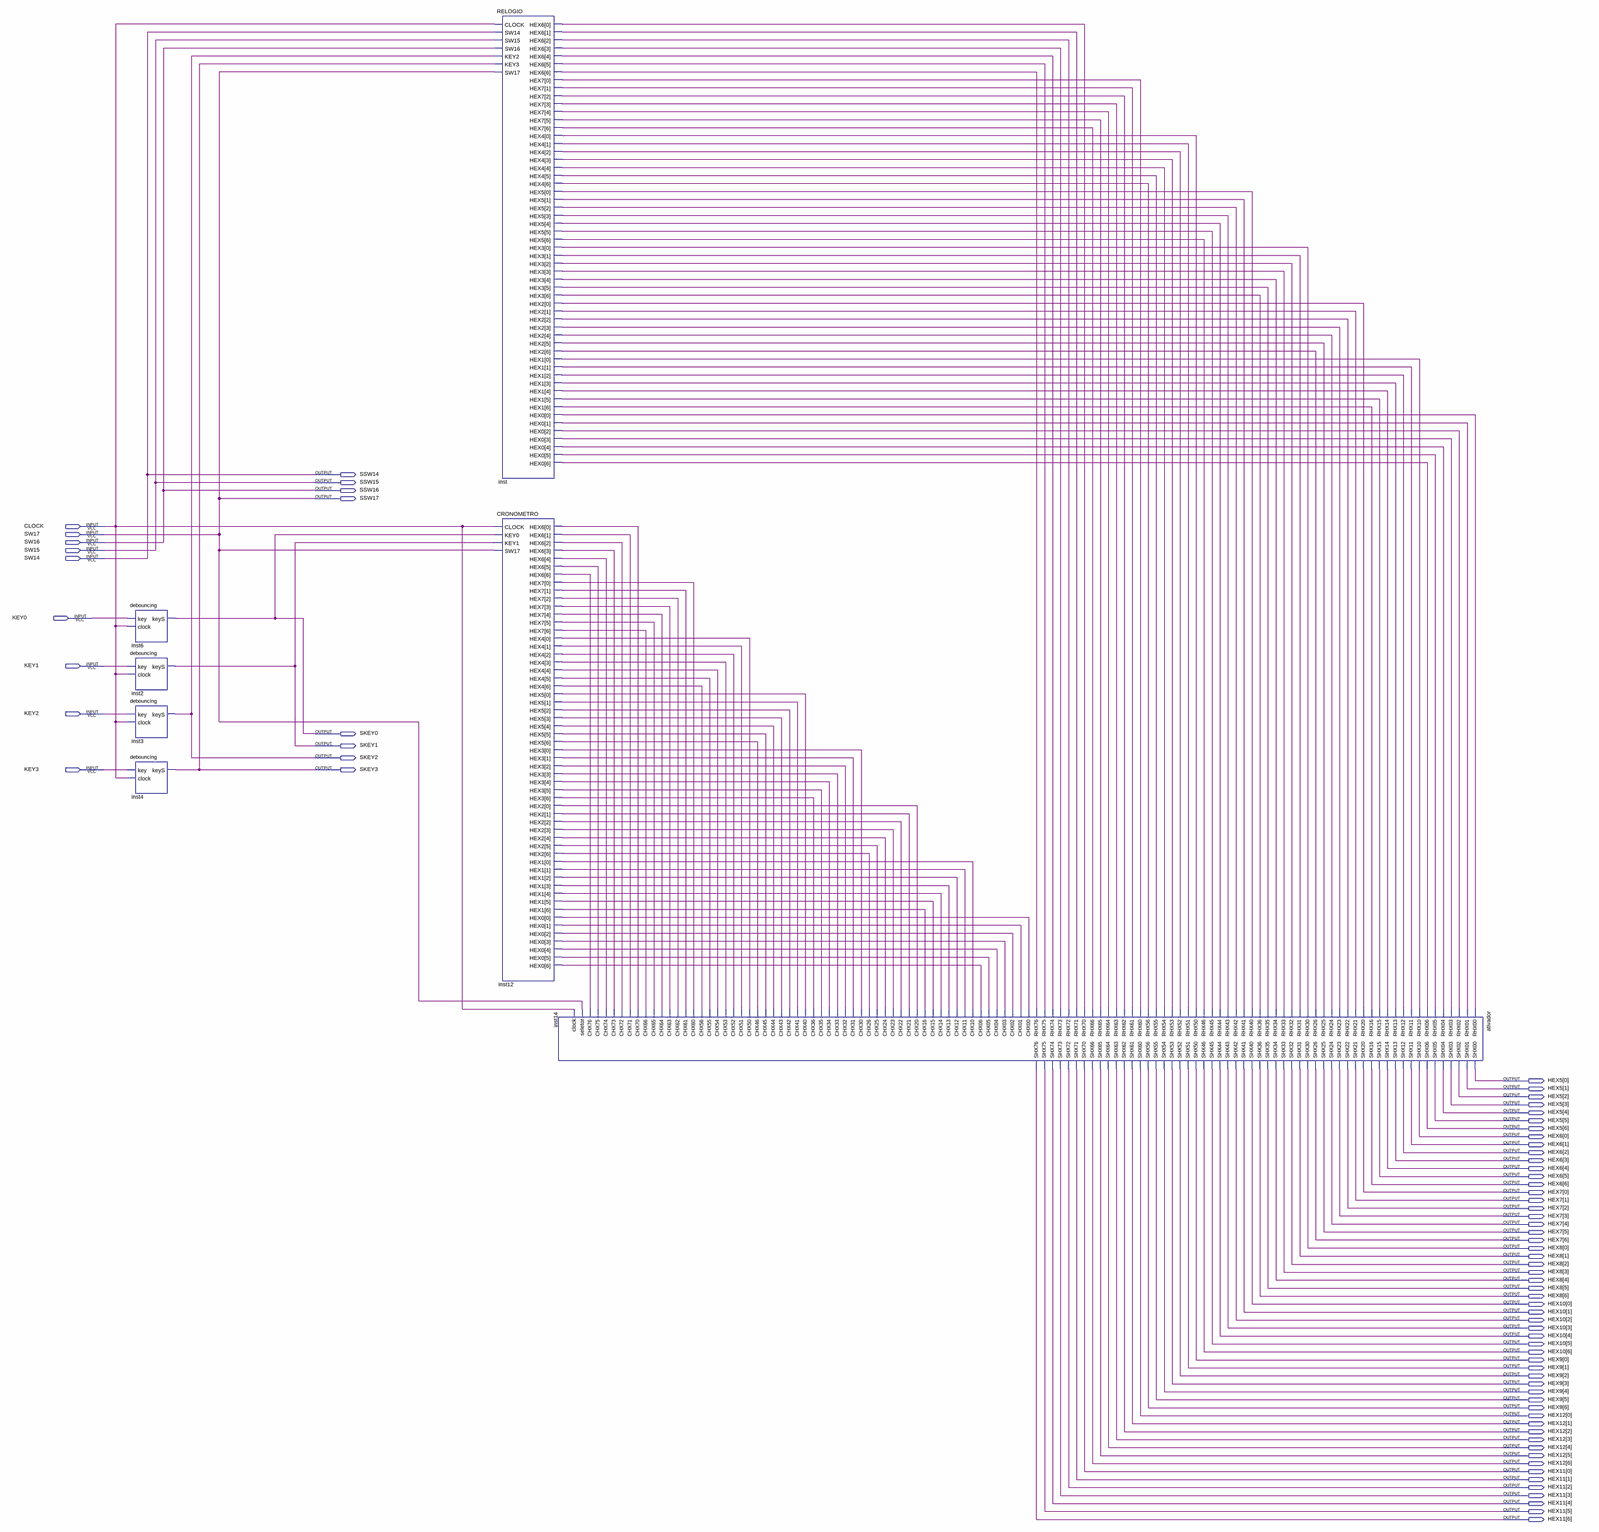
[diagram p0: schematic sheet, whole]
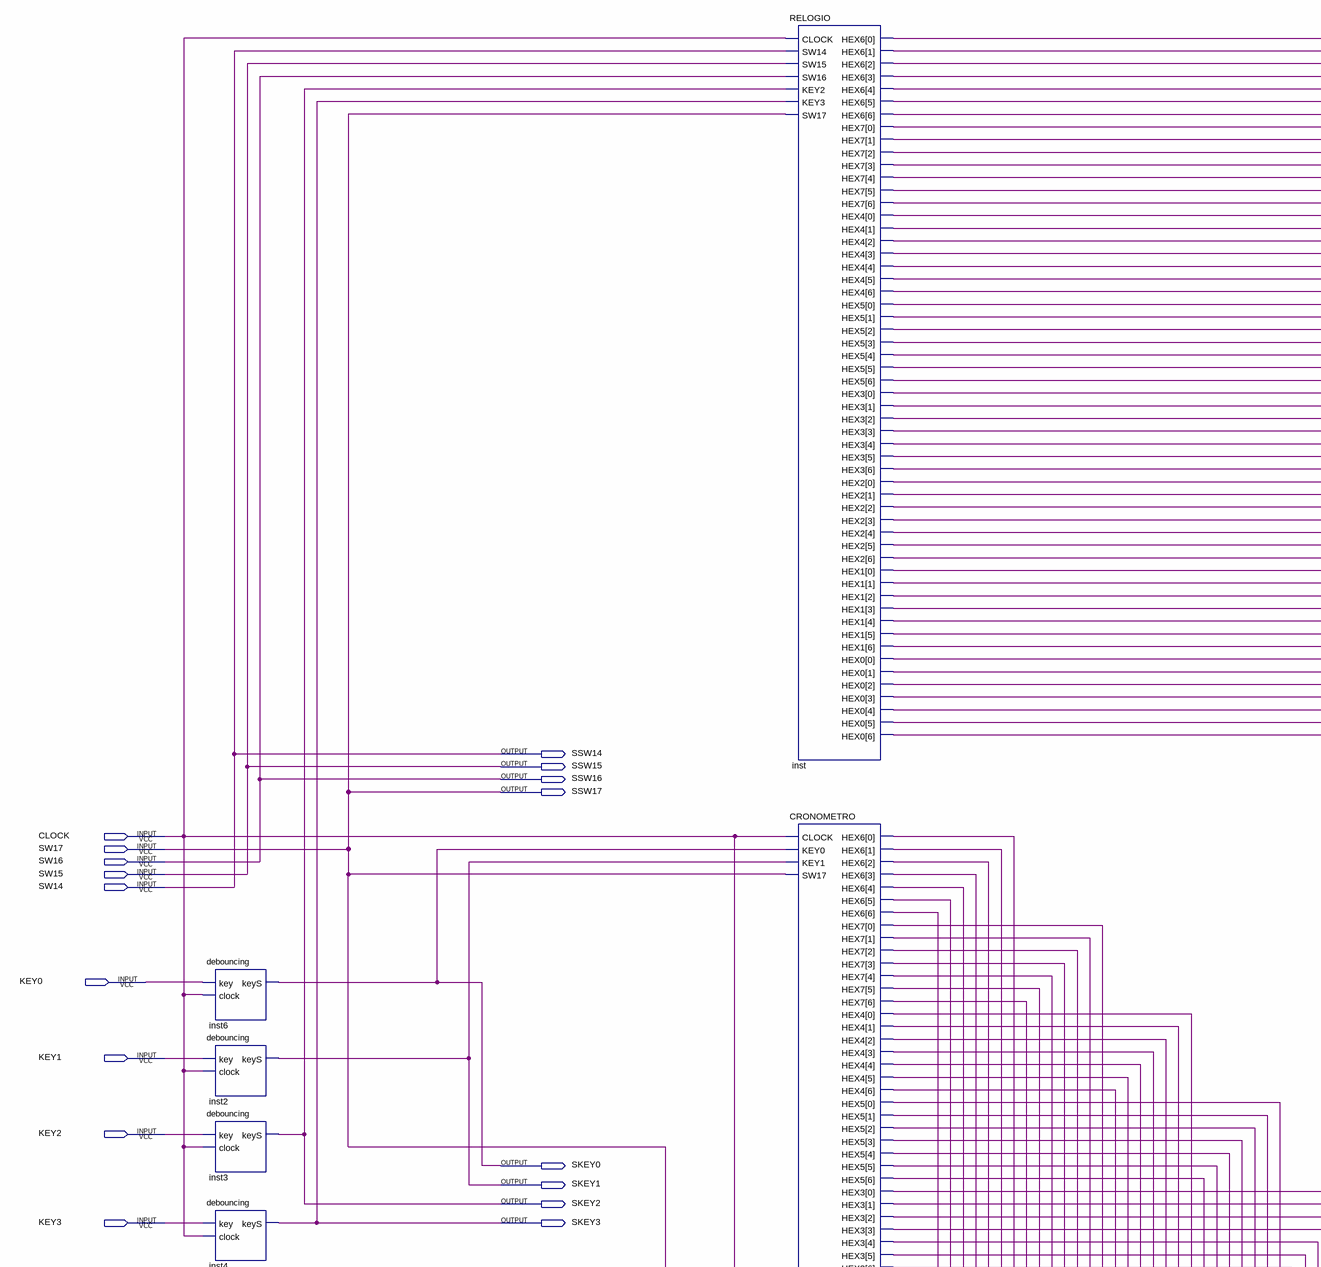
[diagram p1: schematic sheet, upper left part]
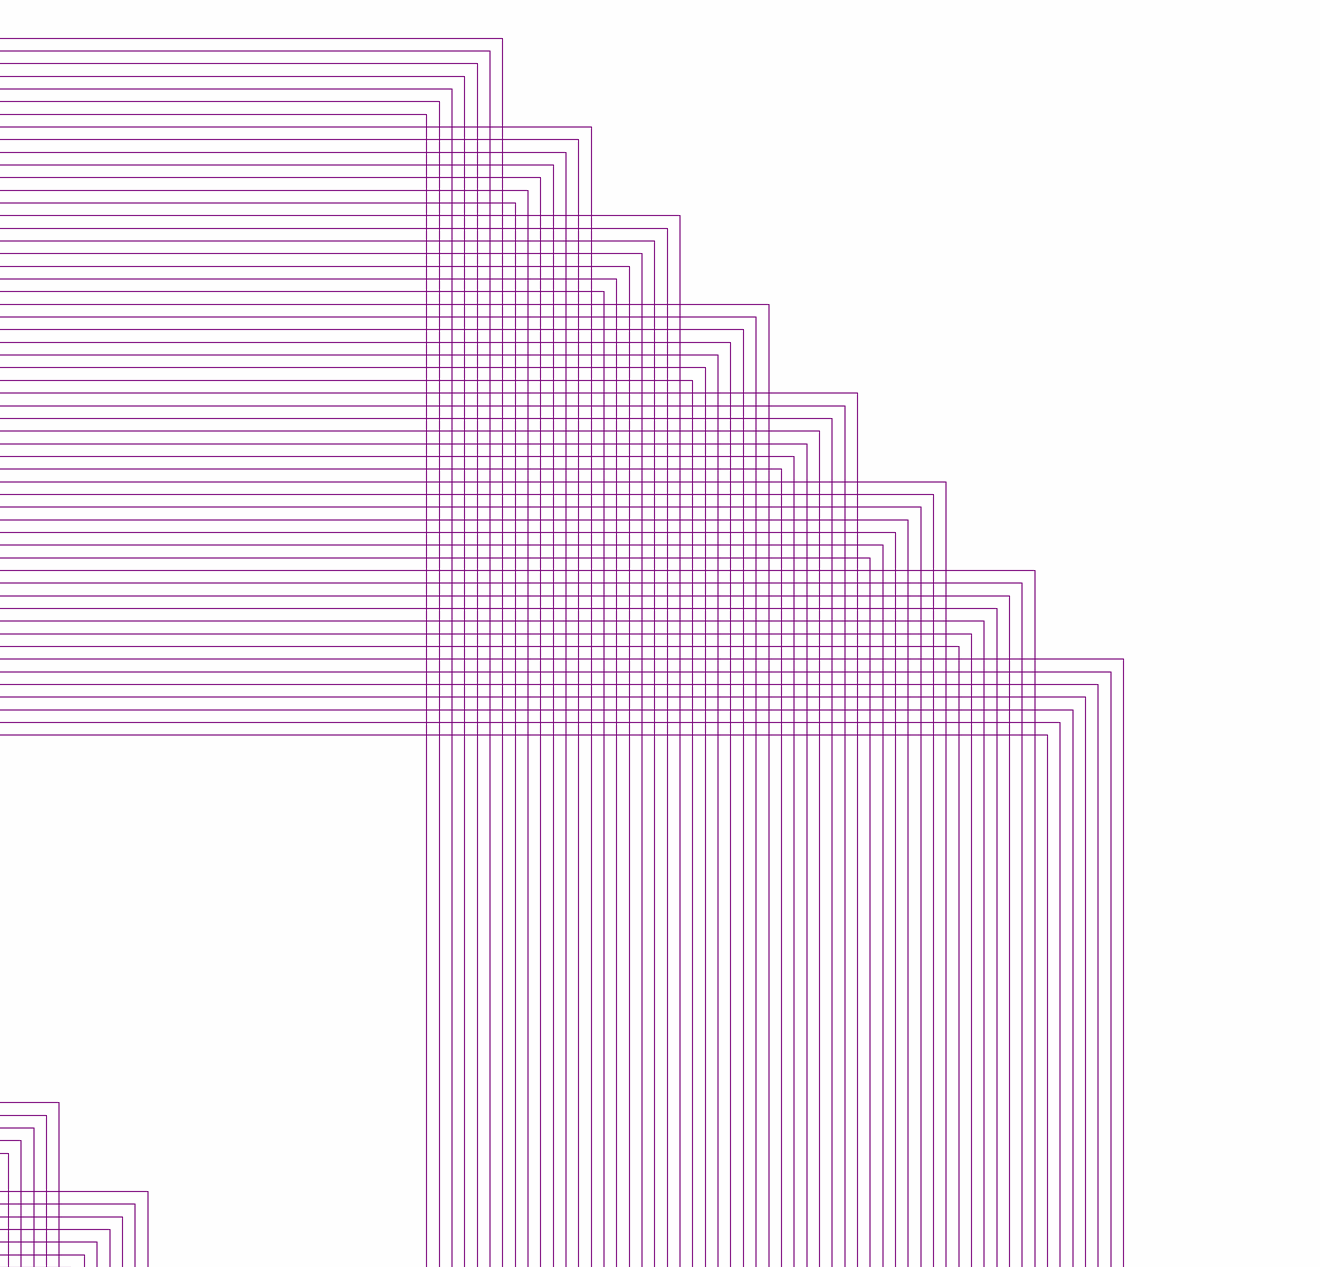
[diagram p2: schematic sheet, upper right part]
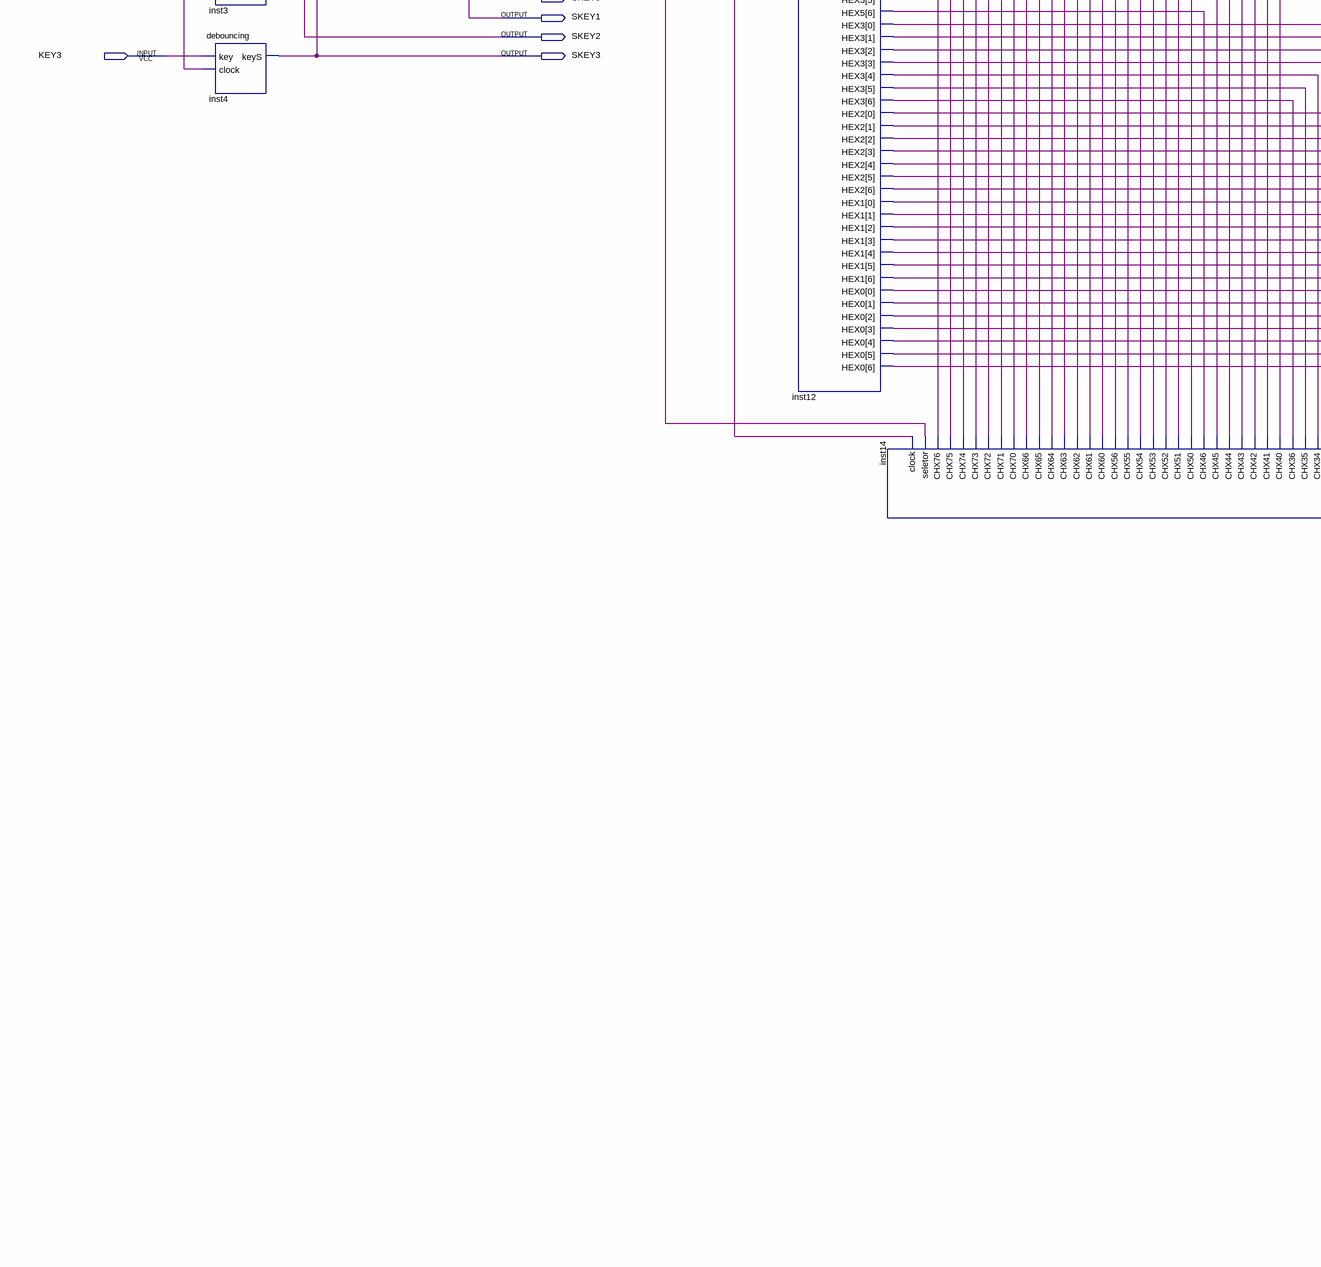
[diagram p3: schematic sheet, lower left part]
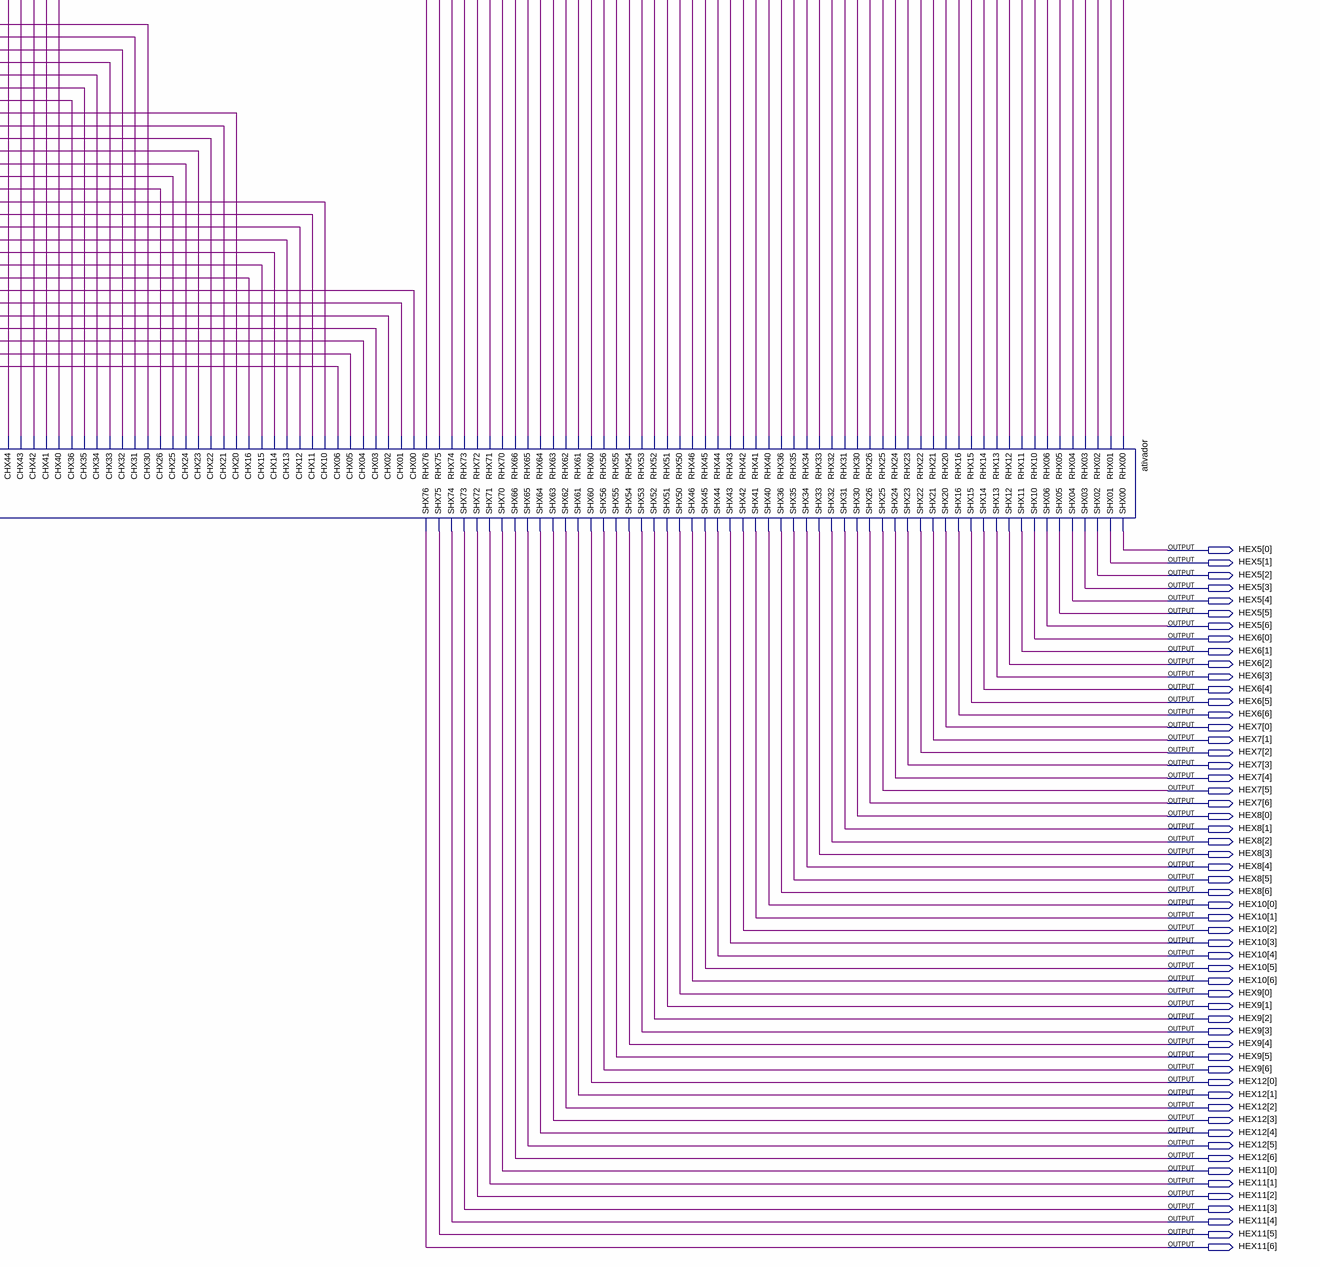
[diagram p4: schematic sheet, lower right part]
// Quartus schematic projeto.bdf as structural Verilog: 7 symbols, 73 pins
module projeto (
  input  CLOCK,
  input  SW17,
  input  SW16,
  input  SW15,
  input  SW14,
  input  KEY0,
  input  KEY1,
  input  KEY2,
  input  KEY3,
  output SSW14,
  output SSW15,
  output SSW16,
  output SSW17,
  output SKEY0,
  output SKEY1,
  output SKEY2,
  output SKEY3,
  output [6:0] HEX5,
  output [6:0] HEX6,
  output [6:0] HEX7,
  output [6:0] HEX8,
  output [6:0] HEX10,
  output [6:0] HEX9,
  output [6:0] HEX12,
  output [6:0] HEX11
);

  wire inst12_hex0, inst12_hex0_2, inst12_hex0_3, inst12_hex0_4, inst12_hex0_5, inst12_hex0_6, inst12_hex0_7,
       inst12_hex1, inst12_hex1_2, inst12_hex1_3, inst12_hex1_4, inst12_hex1_5, inst12_hex1_6, inst12_hex1_7,
       inst12_hex2, inst12_hex2_2, inst12_hex2_3, inst12_hex2_4, inst12_hex2_5, inst12_hex2_6, inst12_hex2_7,
       inst12_hex3, inst12_hex3_2, inst12_hex3_3, inst12_hex3_4, inst12_hex3_5, inst12_hex3_6, inst12_hex3_7,
       inst12_hex4, inst12_hex4_2, inst12_hex4_3, inst12_hex4_4, inst12_hex4_5, inst12_hex4_6, inst12_hex4_7,
       inst12_hex5, inst12_hex5_2, inst12_hex5_3, inst12_hex5_4, inst12_hex5_5, inst12_hex5_6, inst12_hex5_7,
       inst12_hex6, inst12_hex6_2, inst12_hex6_3, inst12_hex6_4, inst12_hex6_5, inst12_hex6_6, inst12_hex6_7,
       inst12_hex7, inst12_hex7_2, inst12_hex7_3, inst12_hex7_4, inst12_hex7_5, inst12_hex7_6, inst12_hex7_7,
       inst_hex0, inst_hex0_2, inst_hex0_3, inst_hex0_4, inst_hex0_5, inst_hex0_6, inst_hex0_7, inst_hex1,
       inst_hex1_2, inst_hex1_3, inst_hex1_4, inst_hex1_5, inst_hex1_6, inst_hex1_7, inst_hex2, inst_hex2_2,
       inst_hex2_3, inst_hex2_4, inst_hex2_5, inst_hex2_6, inst_hex2_7, inst_hex3, inst_hex3_2, inst_hex3_3,
       inst_hex3_4, inst_hex3_5, inst_hex3_6, inst_hex3_7, inst_hex4, inst_hex4_2, inst_hex4_3, inst_hex4_4,
       inst_hex4_5, inst_hex4_6, inst_hex4_7, inst_hex5, inst_hex5_2, inst_hex5_3, inst_hex5_4, inst_hex5_5,
       inst_hex5_6, inst_hex5_7, inst_hex6, inst_hex6_2, inst_hex6_3, inst_hex6_4, inst_hex6_5, inst_hex6_6,
       inst_hex6_7, inst_hex7, inst_hex7_2, inst_hex7_3, inst_hex7_4, inst_hex7_5, inst_hex7_6, inst_hex7_7;

  debouncing inst6 (.key(KEY0), .clock(CLOCK), .keyS(SKEY0));
  debouncing inst2 (.key(KEY1), .clock(CLOCK), .keyS(SKEY1));
  debouncing inst3 (.key(KEY2), .clock(CLOCK), .keyS(SKEY2));
  debouncing inst4 (.key(KEY3), .clock(CLOCK), .keyS(SKEY3));
  RELOGIO inst (
    .CLOCK(CLOCK), .SW14(SW14), .SW15(SW15), .SW16(SW16), .KEY2(SKEY2), .KEY3(SKEY3), .SW17(SW17),
    .HEX6({inst_hex6_3, inst_hex6_2, inst_hex6, inst_hex6_7, inst_hex6_6, inst_hex6_5, inst_hex6_4}),
    .HEX7({inst_hex7_5, inst_hex7_2, inst_hex7_7, inst_hex7_4, inst_hex7, inst_hex7_3, inst_hex7_6}),
    .HEX4({inst_hex4_3, inst_hex4_7, inst_hex4_6, inst_hex4_2, inst_hex4_5, inst_hex4_4, inst_hex4}),
    .HEX5({inst_hex5, inst_hex5_7, inst_hex5_6, inst_hex5_5, inst_hex5_4, inst_hex5_3, inst_hex5_2}),
    .HEX3({inst_hex3_5, inst_hex3_2, inst_hex3, inst_hex3_6, inst_hex3_7, inst_hex3_4, inst_hex3_3}),
    .HEX2({inst_hex2_3, inst_hex2_2, inst_hex2_7, inst_hex2_6, inst_hex2_5, inst_hex2_4, inst_hex2}),
    .HEX1({inst_hex1_7, inst_hex1_6, inst_hex1_5, inst_hex1_4, inst_hex1_3, inst_hex1_2, inst_hex1}),
    .HEX0({inst_hex0_7, inst_hex0_6, inst_hex0_5, inst_hex0_4, inst_hex0_3, inst_hex0_2, inst_hex0}));
  CRONOMETRO inst12 (
    .CLOCK(CLOCK), .KEY0(SKEY0), .KEY1(SKEY1), .SW17(SW17),
    .HEX6({inst12_hex6_4, inst12_hex6_3, inst12_hex6_2, inst12_hex6_7, inst12_hex6_5, inst12_hex6_6, inst12_hex6}),
    .HEX7({inst12_hex7, inst12_hex7_4, inst12_hex7_6, inst12_hex7_3, inst12_hex7_7, inst12_hex7_5, inst12_hex7_2}),
    .HEX4({inst12_hex4_2, inst12_hex4_7, inst12_hex4_6, inst12_hex4_3, inst12_hex4_4, inst12_hex4_5, inst12_hex4}),
    .HEX5({inst12_hex5_7, inst12_hex5_6, inst12_hex5_5, inst12_hex5_4, inst12_hex5_3, inst12_hex5_2, inst12_hex5}),
    .HEX3({inst12_hex3, inst12_hex3_2, inst12_hex3_3, inst12_hex3_6, inst12_hex3_7, inst12_hex3_5, inst12_hex3_4}),
    .HEX2({inst12_hex2, inst12_hex2_2, inst12_hex2_5, inst12_hex2_6, inst12_hex2_4, inst12_hex2_7, inst12_hex2_3}),
    .HEX1({inst12_hex1, inst12_hex1_2, inst12_hex1_3, inst12_hex1_4, inst12_hex1_5, inst12_hex1_6, inst12_hex1_7}),
    .HEX0({inst12_hex0_2, inst12_hex0_3, inst12_hex0_4, inst12_hex0_5, inst12_hex0_6, inst12_hex0_7, inst12_hex0}));
  ativador inst14 (
    .RHX00(inst_hex0), .RHX01(inst_hex0_2), .RHX02(inst_hex0_3), .RHX03(inst_hex0_4), .RHX04(inst_hex0_5),
    .RHX05(inst_hex0_6), .RHX06(inst_hex0_7), .RHX10(inst_hex1), .RHX11(inst_hex1_2), .RHX12(inst_hex1_3),
    .RHX13(inst_hex1_4), .RHX14(inst_hex1_5), .RHX15(inst_hex1_6), .RHX16(inst_hex1_7), .RHX20(inst_hex2),
    .RHX21(inst_hex2_4), .RHX22(inst_hex2_5), .RHX23(inst_hex2_6), .RHX24(inst_hex2_7), .RHX25(inst_hex2_2),
    .RHX26(inst_hex2_3), .RHX30(inst_hex3_3), .RHX31(inst_hex3_4), .RHX32(inst_hex3_7), .RHX33(inst_hex3_6),
    .RHX34(inst_hex3), .RHX35(inst_hex3_2), .RHX36(inst_hex3_5), .RHX40(inst_hex5_2), .RHX41(inst_hex5_3),
    .RHX42(inst_hex5_4), .RHX43(inst_hex5_5), .RHX44(inst_hex5_6), .RHX45(inst_hex5_7), .RHX46(inst_hex5),
    .RHX50(inst_hex4), .RHX51(inst_hex4_4), .RHX52(inst_hex4_5), .RHX53(inst_hex4_2), .RHX54(inst_hex4_6),
    .RHX55(inst_hex4_7), .RHX56(inst_hex4_3), .RHX60(inst_hex7_6), .RHX61(inst_hex7_3), .RHX62(inst_hex7),
    .RHX63(inst_hex7_4), .RHX64(inst_hex7_7), .RHX65(inst_hex7_2), .RHX66(inst_hex7_5), .RHX70(inst_hex6_4),
    .RHX71(inst_hex6_5), .RHX72(inst_hex6_6), .RHX73(inst_hex6_7), .RHX74(inst_hex6), .RHX75(inst_hex6_2),
    .RHX76(inst_hex6_3), .CHX00(inst12_hex0), .CHX01(inst12_hex0_7), .CHX02(inst12_hex0_6),
    .CHX03(inst12_hex0_5), .CHX04(inst12_hex0_4), .CHX05(inst12_hex0_3), .CHX06(inst12_hex0_2),
    .CHX10(inst12_hex1_7), .CHX11(inst12_hex1_6), .CHX12(inst12_hex1_5), .CHX13(inst12_hex1_4),
    .CHX14(inst12_hex1_3), .CHX15(inst12_hex1_2), .CHX16(inst12_hex1), .CHX20(inst12_hex2_3),
    .CHX21(inst12_hex2_7), .CHX22(inst12_hex2_4), .CHX23(inst12_hex2_6), .CHX24(inst12_hex2_5),
    .CHX25(inst12_hex2_2), .CHX26(inst12_hex2), .CHX30(inst12_hex3_4), .CHX31(inst12_hex3_5),
    .CHX32(inst12_hex3_7), .CHX33(inst12_hex3_6), .CHX34(inst12_hex3_3), .CHX35(inst12_hex3_2),
    .CHX36(inst12_hex3), .CHX40(inst12_hex5), .CHX41(inst12_hex5_2), .CHX42(inst12_hex5_3),
    .CHX43(inst12_hex5_4), .CHX44(inst12_hex5_5), .CHX45(inst12_hex5_6), .CHX46(inst12_hex5_7),
    .CHX50(inst12_hex4), .CHX51(inst12_hex4_5), .CHX52(inst12_hex4_4), .CHX53(inst12_hex4_3),
    .CHX54(inst12_hex4_6), .CHX55(inst12_hex4_7), .CHX56(inst12_hex4_2), .CHX60(inst12_hex7_2),
    .CHX61(inst12_hex7_5), .CHX62(inst12_hex7_7), .CHX63(inst12_hex7_3), .CHX64(inst12_hex7_6),
    .CHX65(inst12_hex7_4), .CHX66(inst12_hex7), .CHX70(inst12_hex6), .CHX71(inst12_hex6_6),
    .CHX72(inst12_hex6_5), .CHX73(inst12_hex6_7), .CHX74(inst12_hex6_2), .CHX75(inst12_hex6_3),
    .CHX76(inst12_hex6_4), .seletor(SW17), .clock(CLOCK), .SHX00(HEX5[0]), .SHX01(HEX5[1]), .SHX02(HEX5[2]),
    .SHX03(HEX5[3]), .SHX04(HEX5[4]), .SHX05(HEX5[5]), .SHX06(HEX5[6]), .SHX10(HEX6[0]), .SHX11(HEX6[1]),
    .SHX12(HEX6[2]), .SHX13(HEX6[3]), .SHX14(HEX6[4]), .SHX15(HEX6[5]), .SHX16(HEX6[6]), .SHX20(HEX7[0]),
    .SHX21(HEX7[1]), .SHX22(HEX7[2]), .SHX23(HEX7[3]), .SHX24(HEX7[4]), .SHX25(HEX7[5]), .SHX26(HEX7[6]),
    .SHX30(HEX8[0]), .SHX31(HEX8[1]), .SHX32(HEX8[2]), .SHX33(HEX8[3]), .SHX34(HEX8[4]), .SHX35(HEX8[5]),
    .SHX36(HEX8[6]), .SHX40(HEX10[0]), .SHX41(HEX10[1]), .SHX42(HEX10[2]), .SHX43(HEX10[3]),
    .SHX44(HEX10[4]), .SHX45(HEX10[5]), .SHX46(HEX10[6]), .SHX50(HEX9[0]), .SHX51(HEX9[1]), .SHX52(HEX9[2]),
    .SHX53(HEX9[3]), .SHX54(HEX9[4]), .SHX55(HEX9[5]), .SHX56(HEX9[6]), .SHX60(HEX12[0]), .SHX61(HEX12[1]),
    .SHX62(HEX12[2]), .SHX63(HEX12[3]), .SHX64(HEX12[4]), .SHX65(HEX12[5]), .SHX66(HEX12[6]),
    .SHX70(HEX11[0]), .SHX71(HEX11[1]), .SHX72(HEX11[2]), .SHX73(HEX11[3]), .SHX74(HEX11[4]),
    .SHX75(HEX11[5]), .SHX76(HEX11[6]));

  assign SSW14 = SW14;
  assign SSW15 = SW15;
  assign SSW16 = SW16;
  assign SSW17 = SW17;
endmodule
